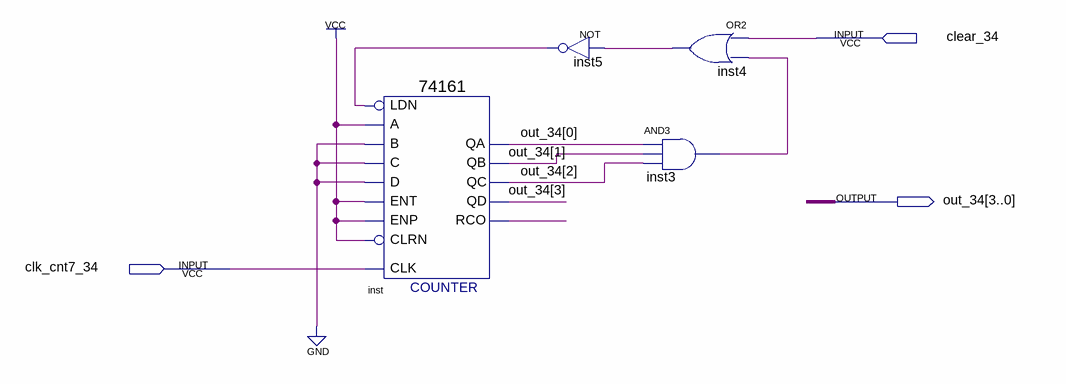
[diagram p0: schematic sheet]
// Quartus schematic cnt7.bdf as structural Verilog: 4 symbols, 3 pins
module cnt7 (
  input  clear_34,
  input  clk_cnt7_34,
  output [3:0] out_34
);

  wire inst3_out, inst4_out, inst5_out, inst_rco;

  \74161  inst (
    .CLRN(1'b1), .CLK(clk_cnt7_34), .ENP(1'b1), .LDN(inst5_out), .A(1'b1), .D(1'b0), .ENT(1'b1), .B(1'b0),
    .C(1'b0), .QD(out_34[3]), .QC(out_34[2]), .QB(out_34[1]), .QA(out_34[0]), .RCO(inst_rco));
  not inst5 (inst5_out, inst4_out);
  or inst4 (inst4_out, clear_34, inst3_out);
  and inst3 (inst3_out, out_34[0], out_34[1], out_34[2]);
endmodule
